# EAGLE schematic MySens-easyRS485-BluePill-V02-011 (EAGLE 7.7.0)
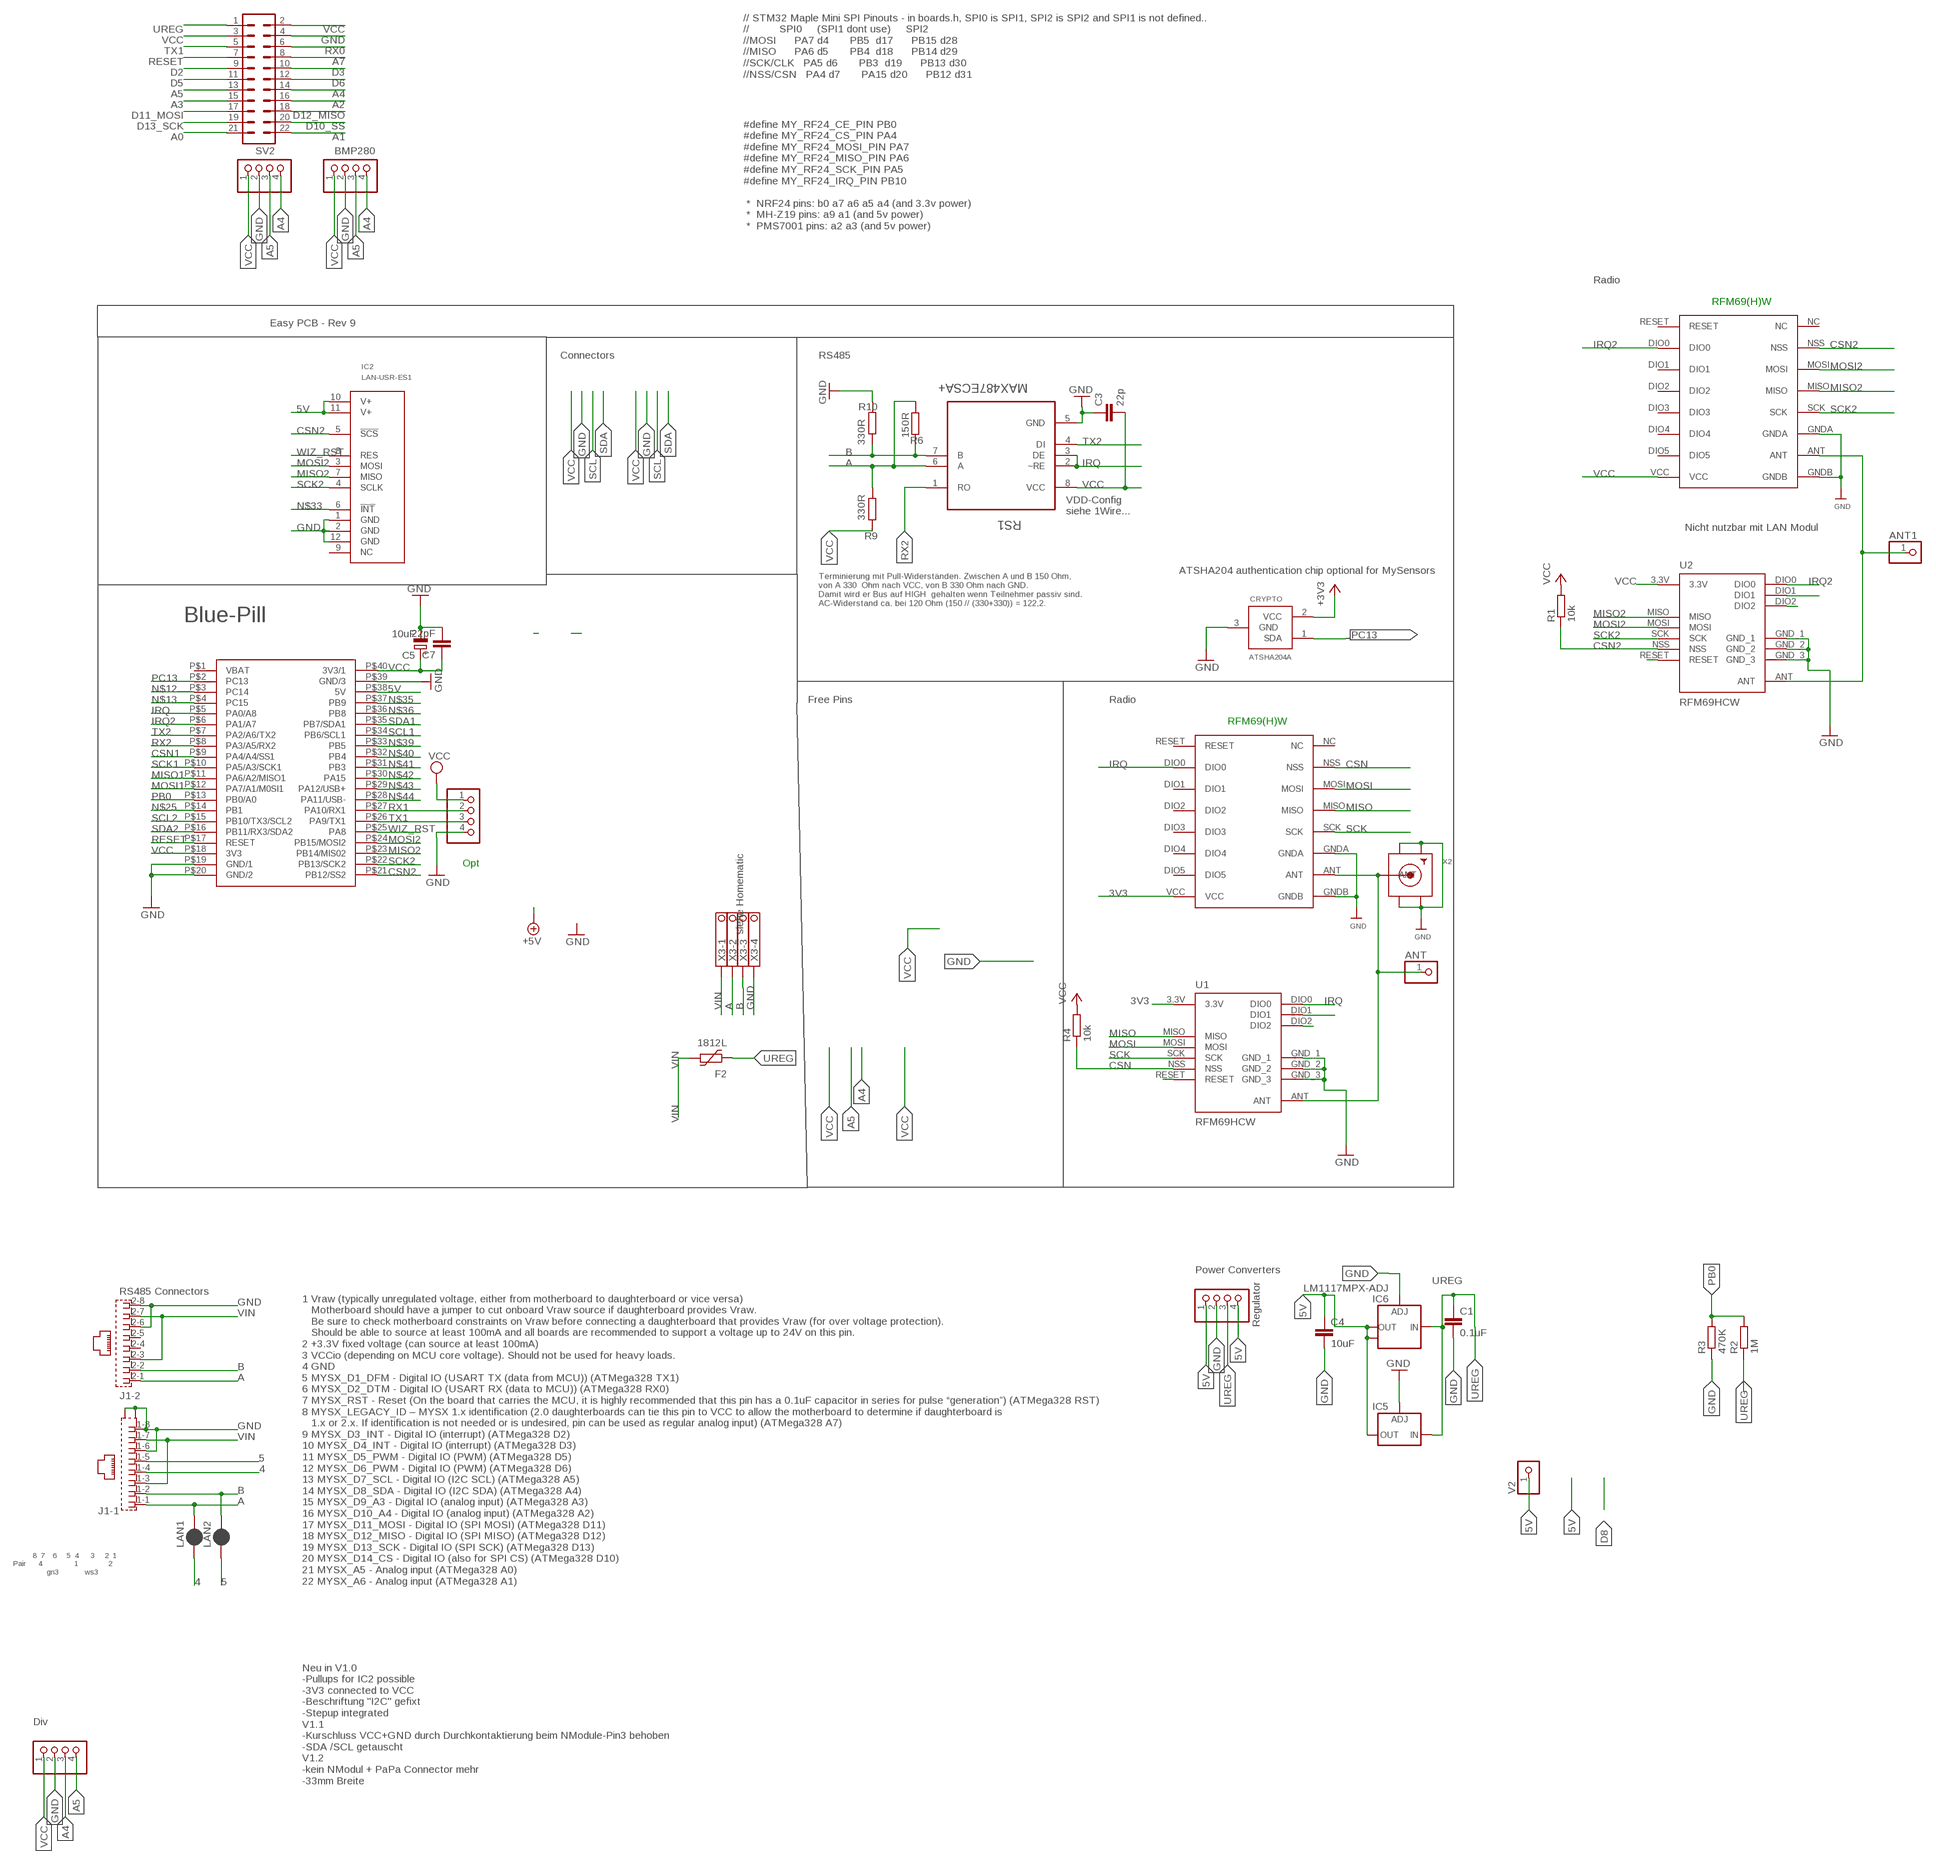
[diagram p0: schematic, sheet 1, part 1 of 2]
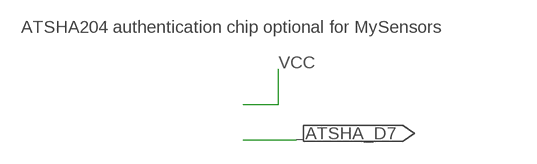
[diagram p1: schematic, sheet 1, part 2 of 2]

## Parts
ANT  PINHD-1X1  [1X01]
ANT1  PINHD-1X1  [1X01]
BH1750  PINHD-1X04_2.54-S  [1X04-S]
C1  0.1uF  C-EUC1206  [C1206]
C3  22p  C-EUC0805  [C0805]
C4  10uF  C-EUC1210  [C1210]
C5  10uF  CPOL-EUR/2012-12W  [R/2012-12W]
C7  22pF  C-EUC0805  [C0805]
CRYPTO  ATSHA204A  [SOT23]
DBG  PINHD-1X04_2.54-S  [1X04-S]
F2  1812L  [1812L]
I2C-1  PINHD-1X04_2.54-S  [1X04-S]
I2C-2  PINHD-1X04_2.54-S  [1X04-S]
IC2  LAN-USR-ES1  [USR-ES1]
IC5  LD117ADT50TR  [DPACK]
IC6  LM1117MPX-ADJ  [SOT223]
J1  RJ45_2X_NARROW_SHILDPINS_NOCASE  [RJ45_2X_NARROW_SHILDPINS_NOCASE]
LAN1  JUMPER-SMT_2_NC_PASTE_SILK  [SMT-JUMPER_2_NC_PASTE_SILK]
LAN2  JUMPER-SMT_2_NC_PASTE_SILK  [SMT-JUMPER_2_NC_PASTE_SILK]
R1  10k  R-EU_M0805  [M0805]
R2  1M  R-EU_R0805  [R0805]
R3  470K  R-EU_R0805  [R0805]
R4  10k  R-EU_M0805  [M0805]
R6  150R  R-EU_R0805  [R0805]
R9  330R  R-EU_R0805  [R0805]
R10  330R  R-EU_R0805  [R0805]
RFM69W  RFM69HW  [RFM]
RFM69W1  RFM69HW  [RFM]
RS1  MAX487ECSA+  [SOIC127P600X175-8N]
STEPDWN  PINHD-1X04_2.54-S  [1X04-S]
SV2  MA11-2  [MA11-2]
U1  RFM69HCW  [RFM69HCW-XXXS2]
U2  RFM69HCW  [RFM69HCW-XXXS2]
U$4  BLUEPILL  [BLUEPILL]
V2  PINHD-1X1  [1X01]
X2  SMACONNECTOR_EDGE  [SMA_EDGELAUNCH]
X3  1751264  [1751264]

## Nets
3V3: CRYPTO.2(VCC) RFM69W.VCC U1.3.3V ; supply symbol labelled +3V3
4: J1.1-4 LAN1.1
5: J1.1-5 LAN2.1
5V: C4.1 IC2.10(V+) IC2.11(V+) IC5.4(OUT) IC6.2(OUT) IC6.TAB(OUT1) STEPDWN.1 STEPDWN.4 U$4.P$38(5V) V2.1
A: J1.1-1 J1.2-1 LAN1.2 R6.1 R9.2 RS1.6(A) X3.2
A0: SV2.21
A1: SV2.22
A2: SV2.16
A3: SV2.15
A4: BH1750.4 I2C-1.4 I2C-2.3 SV2.14
A5: BH1750.3 I2C-1.3 I2C-2.4 SV2.13
A7: SV2.8
ANT: ANT.1 RFM69W.ANT U1.ANT X2.P(ANT)
ANT1: ANT1.1 RFM69W1.ANT U2.ANT
B: J1.1-2 J1.2-2 LAN2.2 R6.2 R10.1 RS1.7(B) X3.3
CSN: R4.1 RFM69W.NSS U1.NSS
CSN1: U$4.P$9(PA4/A4/SS1)
CSN2: IC2.5(!SCS!) R1.1 RFM69W1.NSS U2.NSS U$4.P$21(PB12/SS2)
D2: SV2.9
D3: SV2.10
D5: SV2.11
D6: SV2.12
D10_SS: SV2.20
D11_MOSI: SV2.17
D12_MISO: SV2.18
D13_SCK: SV2.19
GND [PWR]: BH1750.2 C1.2 C3.1 C4.2 C5.- C7.2 CRYPTO.3(GND) DBG.4 I2C-1.2 I2C-2.2 IC2.1(GND) IC2.2(GND) IC2.12(GND) IC5.1(ADJ) IC6.1(ADJ) J1.1-6 J1.1-8 J1.2-6 J1.2-8 J1.G1(-1:S1) J1.G3(-1:S2) R3.1 R10.2 RFM69W1.GNDA RFM69W1.GNDB RFM69W.GNDA RFM69W.GNDB RS1.5(GND) STEPDWN.2 SV2.4 U1.GND_1 U1.GND_2 U1.GND_3 U2.GND_1 U2.GND_2 U2.GND_3 U$4.P$19(GND/1) U$4.P$20(GND/2) U$4.P$39(GND/3) X2.GND@1(GND4) X2.GND@2(GND3) X2.GND@3(GND2) X2.GND@4(GND1) X3.4
IRQ: RFM69W.DIO0 RS1.2(~RE) RS1.3(DE) U1.DIO0 U$4.P$5(PA0/A8)
IRQ2: RFM69W1.DIO0 U2.DIO0 U$4.P$6(PA1/A7)
MISO: RFM69W.MISO U1.MISO
MISO1: U$4.P$11(PA6/A2/MISO1)
MISO2: IC2.7(MISO) RFM69W1.MISO U2.MISO U$4.P$23(PB14/MIS02)
MOSI: RFM69W.MOSI U1.MOSI
MOSI1: U$4.P$12(PA7/A1/M0SI1)
MOSI2: IC2.3(MOSI) RFM69W1.MOSI U2.MOSI U$4.P$24(PB15/MOSI2)
N$1: U1.RESET
N$4: U2.DIO2
N$8: U2.DIO1
N$9: U2.RESET
N$12: U$4.P$3(PC14)
N$13: U$4.P$4(PC15)
N$14: U1.DIO2
N$15: U1.DIO1
N$25: U$4.P$14(PB1)
N$33: IC2.6(!INT!)
N$35: U$4.P$37(PB9)
N$36: U$4.P$36(PB8)
N$39: U$4.P$33(PB5)
N$40: U$4.P$32(PB4)
N$41: U$4.P$31(PB3)
N$42: U$4.P$30(PA15)
N$43: U$4.P$29(PA12/USB+)
N$44: U$4.P$28(PA11/USB-)
PB0: R2.2 R3.2 U$4.P$13(PB0/A0)
PC13: CRYPTO.1(SDA) U$4.P$2(PC13)
RESET: SV2.7 U$4.P$17(RESET)
RX0: SV2.6
RX1: DBG.2 U$4.P$27(PA10/RX1)
RX2: RS1.1(RO) U$4.P$8(PA3/A5/RX2)
SCK: RFM69W.SCK U1.SCK
SCK1: U$4.P$10(PA5/A3/SCK1)
SCK2: IC2.4(SCLK) RFM69W1.SCK U2.SCK U$4.P$22(PB13/SCK2)
SCL1: U$4.P$34(PB6/SCL1)
SCL2: U$4.P$15(PB10/TX3/SCL2)
SDA1: U$4.P$35(PB7/SDA1)
SDA2: U$4.P$16(PB11/RX3/SDA2)
TX1: DBG.3 SV2.5 U$4.P$26(PA9/TX1)
TX2: RS1.4(DI) U$4.P$7(PA2/A6/TX2)
UREG [PWR]: C1.1 F2.P$1 IC5.3(IN) IC6.3(IN) R2.1 STEPDWN.3 SV2.1
VCC [PWR]: BH1750.1 C3.2 C5.+ C7.1 DBG.1 I2C-1.1 I2C-2.1 R1.2 R4.2 R9.1 RFM69W1.VCC RS1.8(VCC) SV2.2 SV2.3 U2.3.3V U$4.P$18(3V3) U$4.P$40(3V3/1)
VIN [PWR]: F2.P$2 J1.1-3 J1.1-7 J1.2-3 J1.2-7 X3.1
WIZ_RST: IC2.8(RES) U$4.P$25(PA8)
Unconnected: IC2.9(NC) J1.2-4 J1.2-5 RFM69W1.DIO1 RFM69W1.DIO2 RFM69W1.DIO3 RFM69W1.DIO4 RFM69W1.DIO5 RFM69W1.NC RFM69W1.RESET RFM69W.DIO1 RFM69W.DIO2 RFM69W.DIO3 RFM69W.DIO4 RFM69W.DIO5 RFM69W.NC RFM69W.RESET U$4.P$1(VBAT)

## Notes on the sheet
- // STM32 Maple Mini SPI Pinouts - in boards.h, SPI0 is SPI1, SPI2 is SPI2 and SPI1 is not defined..
  //          SPI0     (SPI1 dont use)     SPI2
  //MOSI      PA7 d4       PB5  d17      PB15 d28
  //MISO      PA6 d5       PB4  d18      PB14 d29
  //SCK/CLK   PA5 d6       PB3  d19      PB13 d30
  //NSS/CSN   PA4 d7       PA15 d20      PB12 d31
- BMP280
- #define MY_RF24_CE_PIN PB0 
  #define MY_RF24_CS_PIN PA4 
  #define MY_RF24_MOSI_PIN PA7 
  #define MY_RF24_MISO_PIN PA6 
  #define MY_RF24_SCK_PIN PA5 
  #define MY_RF24_IRQ_PIN PB10
  
   *  NRF24 pins: b0 a7 a6 a5 a4 (and 3.3v power)
   *  MH-Z19 pins: a9 a1 (and 5v power)
   *  PMS7001 pins: a2 a3 (and 5v power)
- Radio
- RFM69(H)W
- Easy PCB - Rev 9
- Connectors | RS485
- VDD-Config
  siehe 1Wire...
- Nicht nutzbar mit LAN Modul
- ATSHA204 authentication chip optional for MySensors
- Terminierung mit Pull-Widerständen. Zwischen A und B 150 Ohm,
  von A 330  Ohm nach VCC, von B 330 Ohm nach GND. 
  Damit wird er Bus auf HIGH  gehalten wenn Teilnehmer passiv sind.
  AC-Widerstand ca. bei 120 Ohm (150 // (330+330)) = 122,2.
- Blue-Pill
- Free Pins | Radio
- RFM69(H)W
- Opt
- siehe Homematic
- Power Converters
- RS485 Connectors
- Regulator
- ATSHA204 authentication chip optional for MySensors
- 8  7    6     5  4      3     2  1
  Pair      4                1               2
                   gn3             ws3
- 1 Vraw (typically unregulated voltage, either from motherboard to daughterboard or vice versa)
     Motherboard should have a jumper to cut onboard Vraw source if daughterboard provides Vraw. 
     Be sure to check motherboard constraints on Vraw before connecting a daughterboard that provides Vraw (for over voltage protection). 
     Should be able to source at least 100mA and all boards are recommended to support a voltage up to 24V on this pin.
  2 +3.3V fixed voltage (can source at least 100mA)
  3 VCCio (depending on MCU core voltage). Should not be used for heavy loads.
  4 GND
  5 MYSX_D1_DFM - Digital IO (USART TX (data from MCU)) (ATMega328 TX1)
  6 MYSX_D2_DTM - Digital IO (USART RX (data to MCU)) (ATMega328 RX0)
  7 MYSX_RST - Reset (On the board that carries the MCU, it is highly recommended that this pin has a 0.1uF capacitor in series for pulse “generation”) (ATMega328 RST)
  8 MYSX_LEGACY_ID – MYSX 1.x identification (2.0 daughterboards can tie this pin to VCC to allow the motherboard to determine if daughterboard is 
     1.x or 2.x. If identification is not needed or is undesired, pin can be used as regular analog input) (ATMega328 A7)
  9 MYSX_D3_INT - Digital IO (interrupt) (ATMega328 D2)
  10 MYSX_D4_INT - Digital IO (interrupt) (ATMega328 D3)
  11 MYSX_D5_PWM - Digital IO (PWM) (ATMega328 D5)
  12 MYSX_D6_PWM - Digital IO (PWM) (ATMega328 D6)
  13 MYSX_D7_SCL - Digital IO (I2C SCL) (ATMega328 A5)
  14 MYSX_D8_SDA - Digital IO (I2C SDA) (ATMega328 A4)
  15 MYSX_D9_A3 - Digital IO (analog input) (ATMega328 A3)
  16 MYSX_D10_A4 - Digital IO (analog input) (ATMega328 A2)
  17 MYSX_D11_MOSI - Digital IO (SPI MOSI) (ATMega328 D11)
  18 MYSX_D12_MISO - Digital IO (SPI MISO) (ATMega328 D12)
  19 MYSX_D13_SCK - Digital IO (SPI SCK) (ATMega328 D13)
  20 MYSX_D14_CS - Digital IO (also for SPI CS) (ATMega328 D10)
  21 MYSX_A5 - Analog input (ATMega328 A0)
  22 MYSX_A6 - Analog input (ATMega328 A1)
- Div
- Neu in V1.0
  -Pullups for IC2 possible
  -3V3 connected to VCC
  -Beschriftung "I2C" gefixt
  -Stepup integrated
  V1.1
  -Kurschluss VCC+GND durch Durchkontaktierung beim NModule-Pin3 behoben
  -SDA /SCL getauscht
  V1.2
  -kein NModul + PaPa Connector mehr
  -33mm Breite

## Library data of the parts
ANT ANT1 V2 = pinhead:PINHD-1X1: PIN HEADER
BH1750 DBG I2C-1 I2C-2 STEPDWN = pinhead-2:PINHD-1X04: PIN HEADER
C1 C3 C4 C7 = rcl:C-EU: CAPACITOR, European symbol
C5 = rcl:CPOL-EU: POLARIZED CAPACITOR, European symbol
CRYPTO = Sensor:ATSHA204A
F2 = ptc-littlefuse:1812L
IC2 = Martin-Communication:LAN-USR-ES1
IC5 = v-reg:LD117A?*: Low drop fixed and adjustable positive voltage regulators 1 A Source: http://www.st.com/stonline/products/literature/ds/7194/ld1117axx.pdf
IC6 = lm1117:LM1117MPX-ADJ
J1 = RJ45:RJ45_2X_NARROW_SHILDPINS_NOCASE: RJ45 connector
LAN1 LAN2 = SparkFun-Jumpers:JUMPER-SMT_2_NC_PASTE: Normally closed solder jumper This jumper has an aperture in the stencil to allow solder paste to bridge the split in the wire so it's normally closed (NC). Wick off the solder to open the connection. Reapply solder to reclose the connection.
R1-R4 R6 R9 R10 = rcl:R-EU_: RESISTOR, European symbol
RFM69W RFM69W1 = hoperf:RFM69HW
RS1 = Maxim_By_element14_Batch_1:MAX487ECSA+: Low-Power, Slew-Rate-Limited RS-485/RS-422 Transceivers; MPN: MAX487ECSA+; OC_FARNELL: 9724532; OC_NEWARK: 68K4803; PACKAGE: SOIC-8; SUPPLIER: Maxim
SV2 = con-Pinheader:MA11-2: PIN HEADER; OC_FARNELL: unknown; OC_NEWARK: unknown
U1 U2 = doug:RFM69H
U$4 = stm32duino boards:BLUEPILL
X2 = adafruit:SMACONNECTOR: SMA Connector 90° DIP SMA Connector, 50 Ohm (4UConnector: 07259)
X3 = con-phoenix-350:1751264: MKDS 1/ 4-3,5 Printklemme Nennstrom: 10 A Bemessungsspannung: 160 V Raster: 3,5 mm Polzahl: 4 Montageart: Löten Anschlussart: Schraubanschluss Anschlussrichtung vom Leiter zur Platine: 0° Source: http://eshop.phoenixcontact.com .. 1751264.pdf; MPN: 1751264; OC_FARNELL: unknown; OC_NEWARK: 10R0934

## Net classes
0 default: width 0.254 mm, clearance 0.205 mm
1 PWR: width 0.406 mm, clearance 0.205 mm to class 0, clearance 0.205 mm